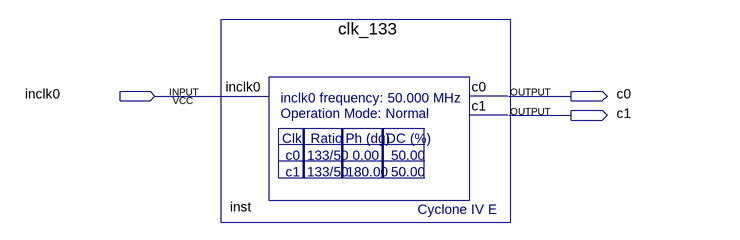
[diagram p0: schematic sheet]
// Quartus schematic teste2.bdf as structural Verilog: 1 symbols, 3 pins
module teste2 (
  input  inclk0,
  output c0,
  output c1
);

  clk_133 inst (.inclk0(inclk0), .c0(c0), .c1(c1));
endmodule
